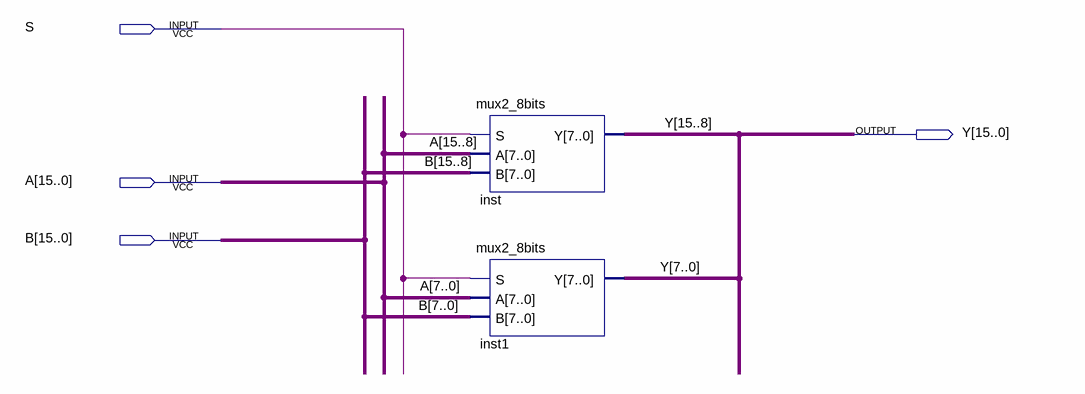
[diagram p0: schematic sheet]
// Quartus schematic mux2_16bits.bdf as structural Verilog: 2 symbols, 4 pins
module mux2_16bits (
  input  S,
  input  [15:0] A,
  input  [15:0] B,
  output [15:0] Y
);

  mux2_8bits inst (.S(S), .A(A[15:8]), .B(B[15:8]), .Y(Y[15:8]));
  mux2_8bits inst1 (.S(S), .A(A[7:0]), .B(B[7:0]), .Y(Y[7:0]));
endmodule
